# Altium schematic sheet 08.PCIE Fun Map.SchDoc
size 594 x 420 mm; Revision: V2.1; Schematic Page Number: 11; Page Number: 9; Check: <Checker>; Schematic Name: RK_NVR_DEMO1_RK3588_LP4/4x_V21; Page Count: 43; Page name: 08.PCIE Fun Map; Designer: Zhangdz; Schematic Page Count: 99; Revcode: V2.1; DsnPath: E:\Work\SBER\RK3588_SOM\temp\RK_NVR_DEMO1_RK3588_LP4XD200P232SD8_V21_20211228.DSN; SchematicName: RK_NVR_DEMO1_RK3588_LP4/4x_V21; PageName: 08.PCIE Fun Map; PageSize: A2; TopSchematic: True
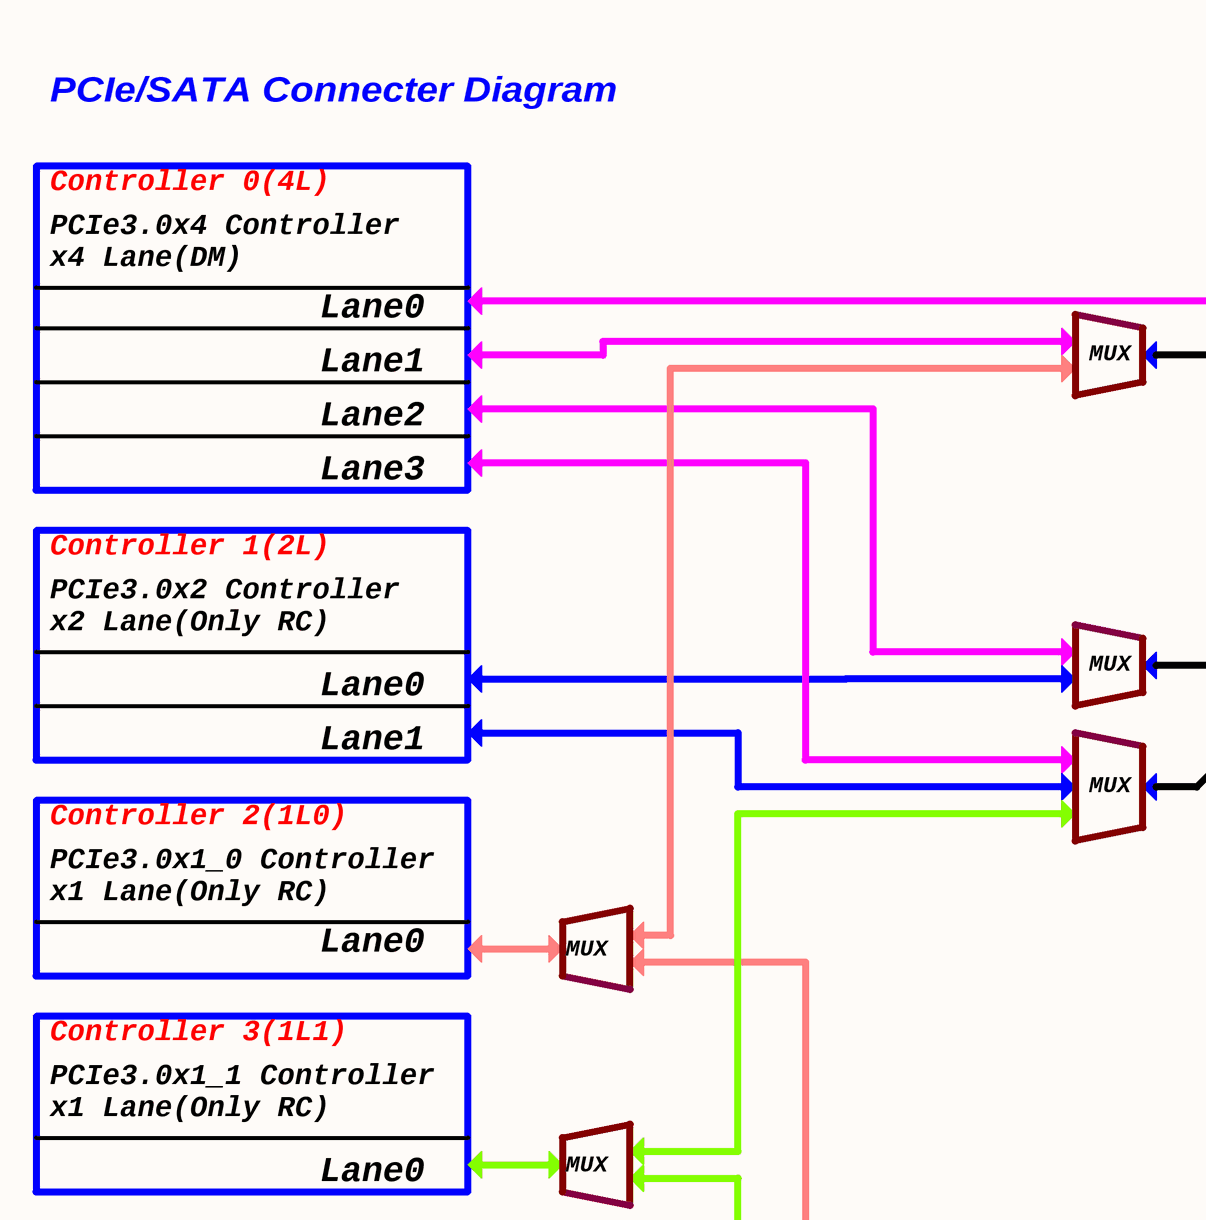
[diagram p0: 08.PCIE Fun Map.SchDoc, top left]
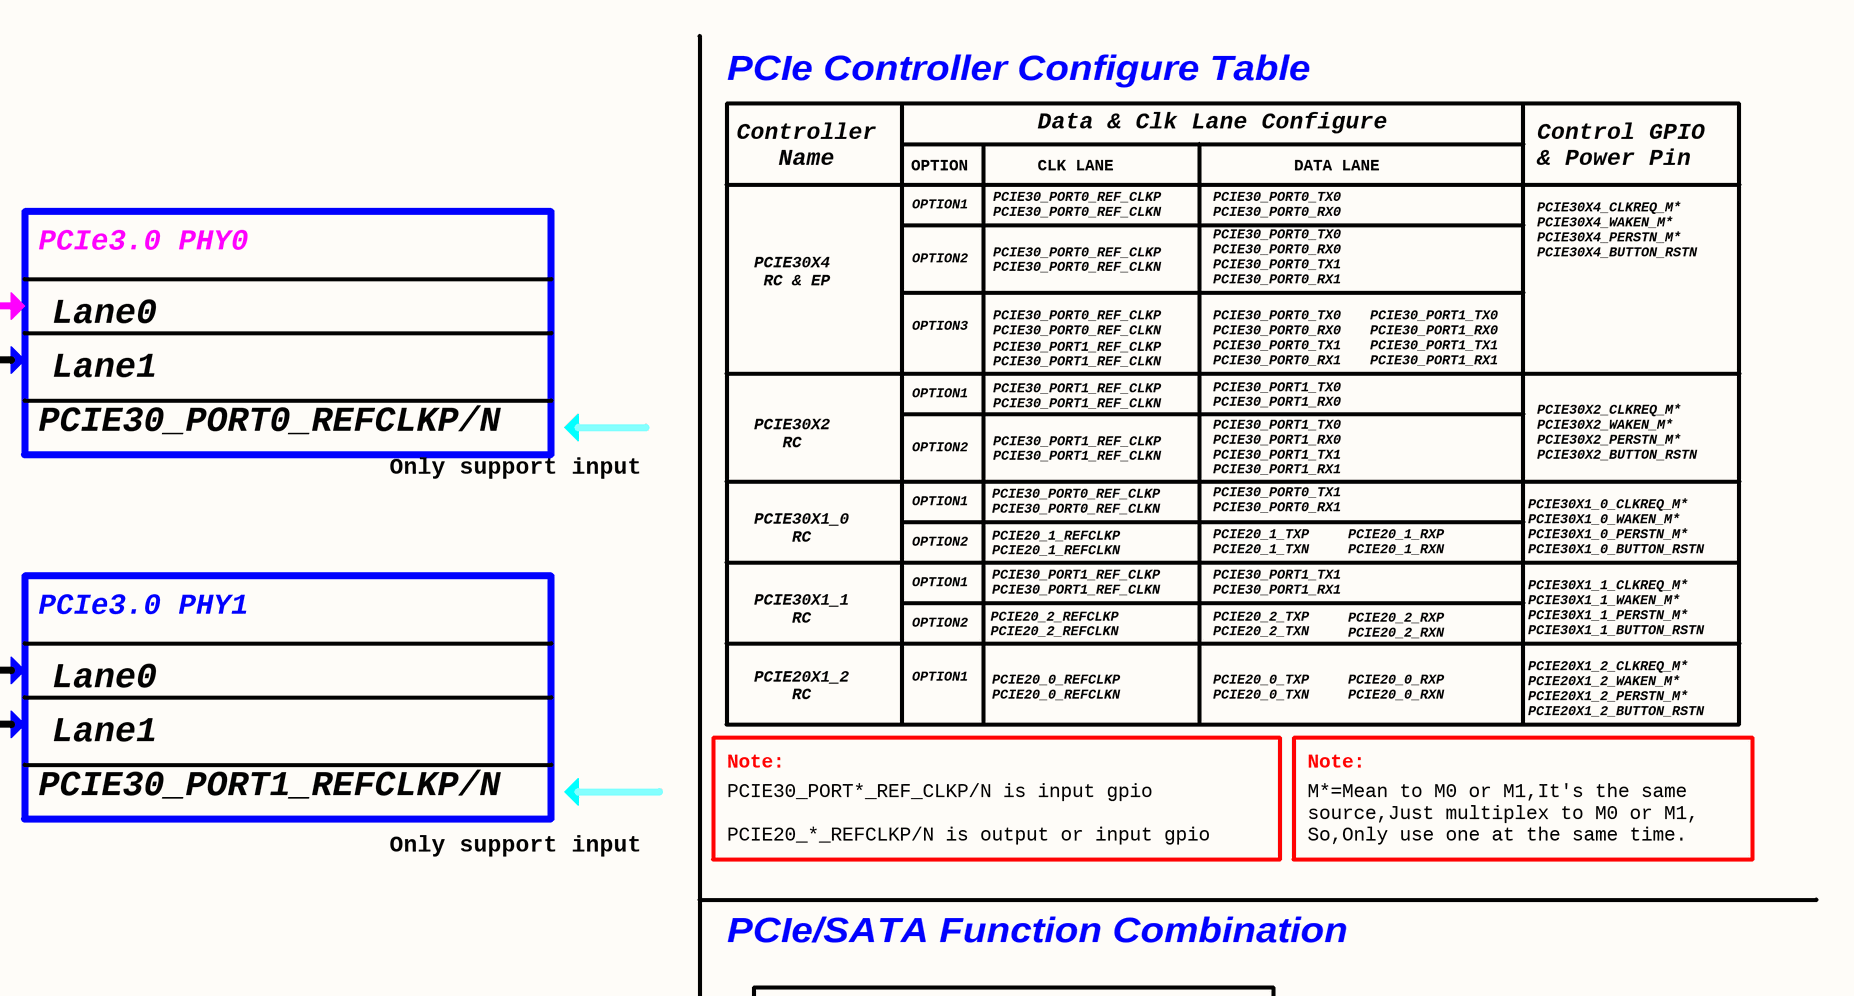
[diagram p1: 08.PCIE Fun Map.SchDoc, top right]
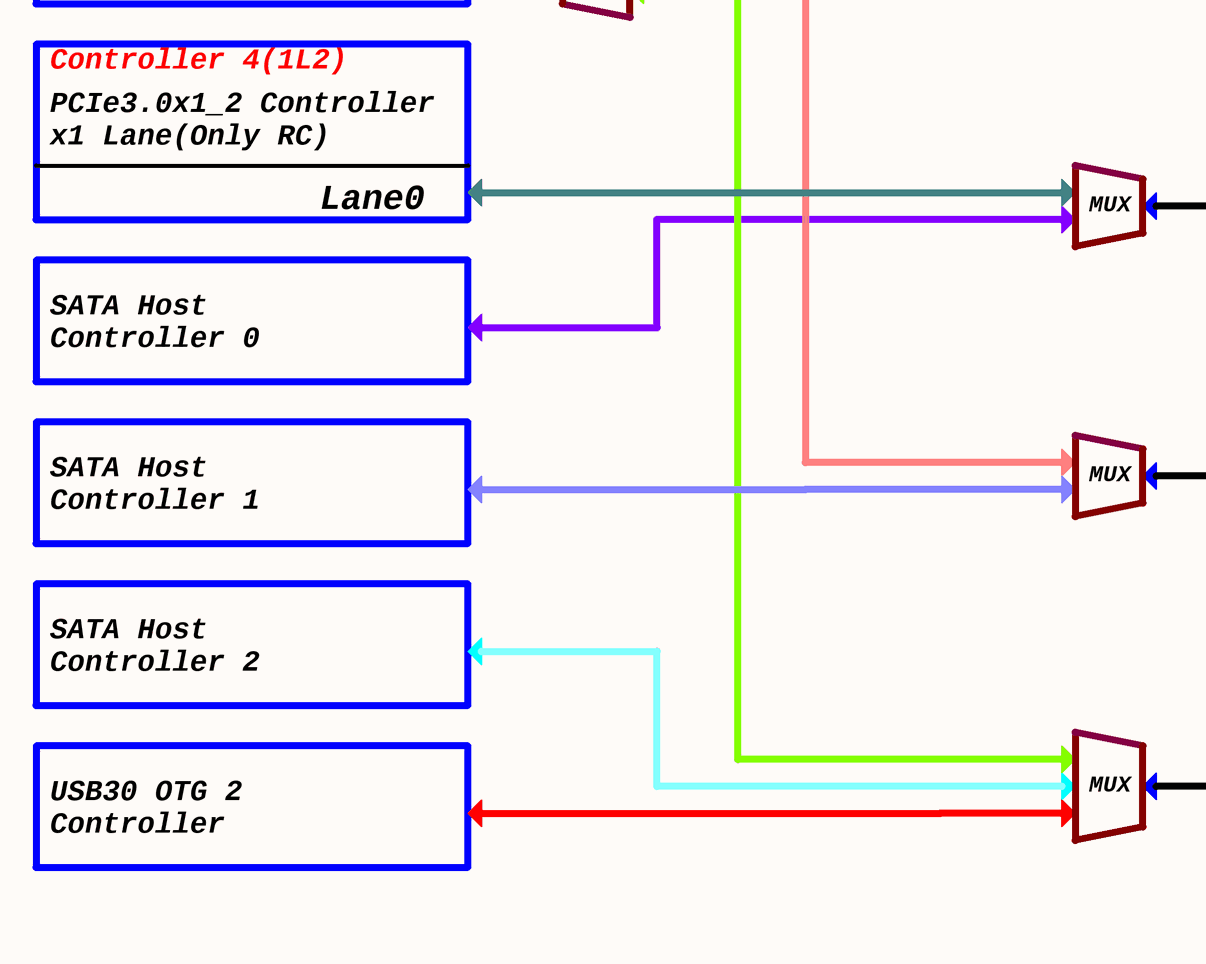
[diagram p2: 08.PCIE Fun Map.SchDoc, bottom left]
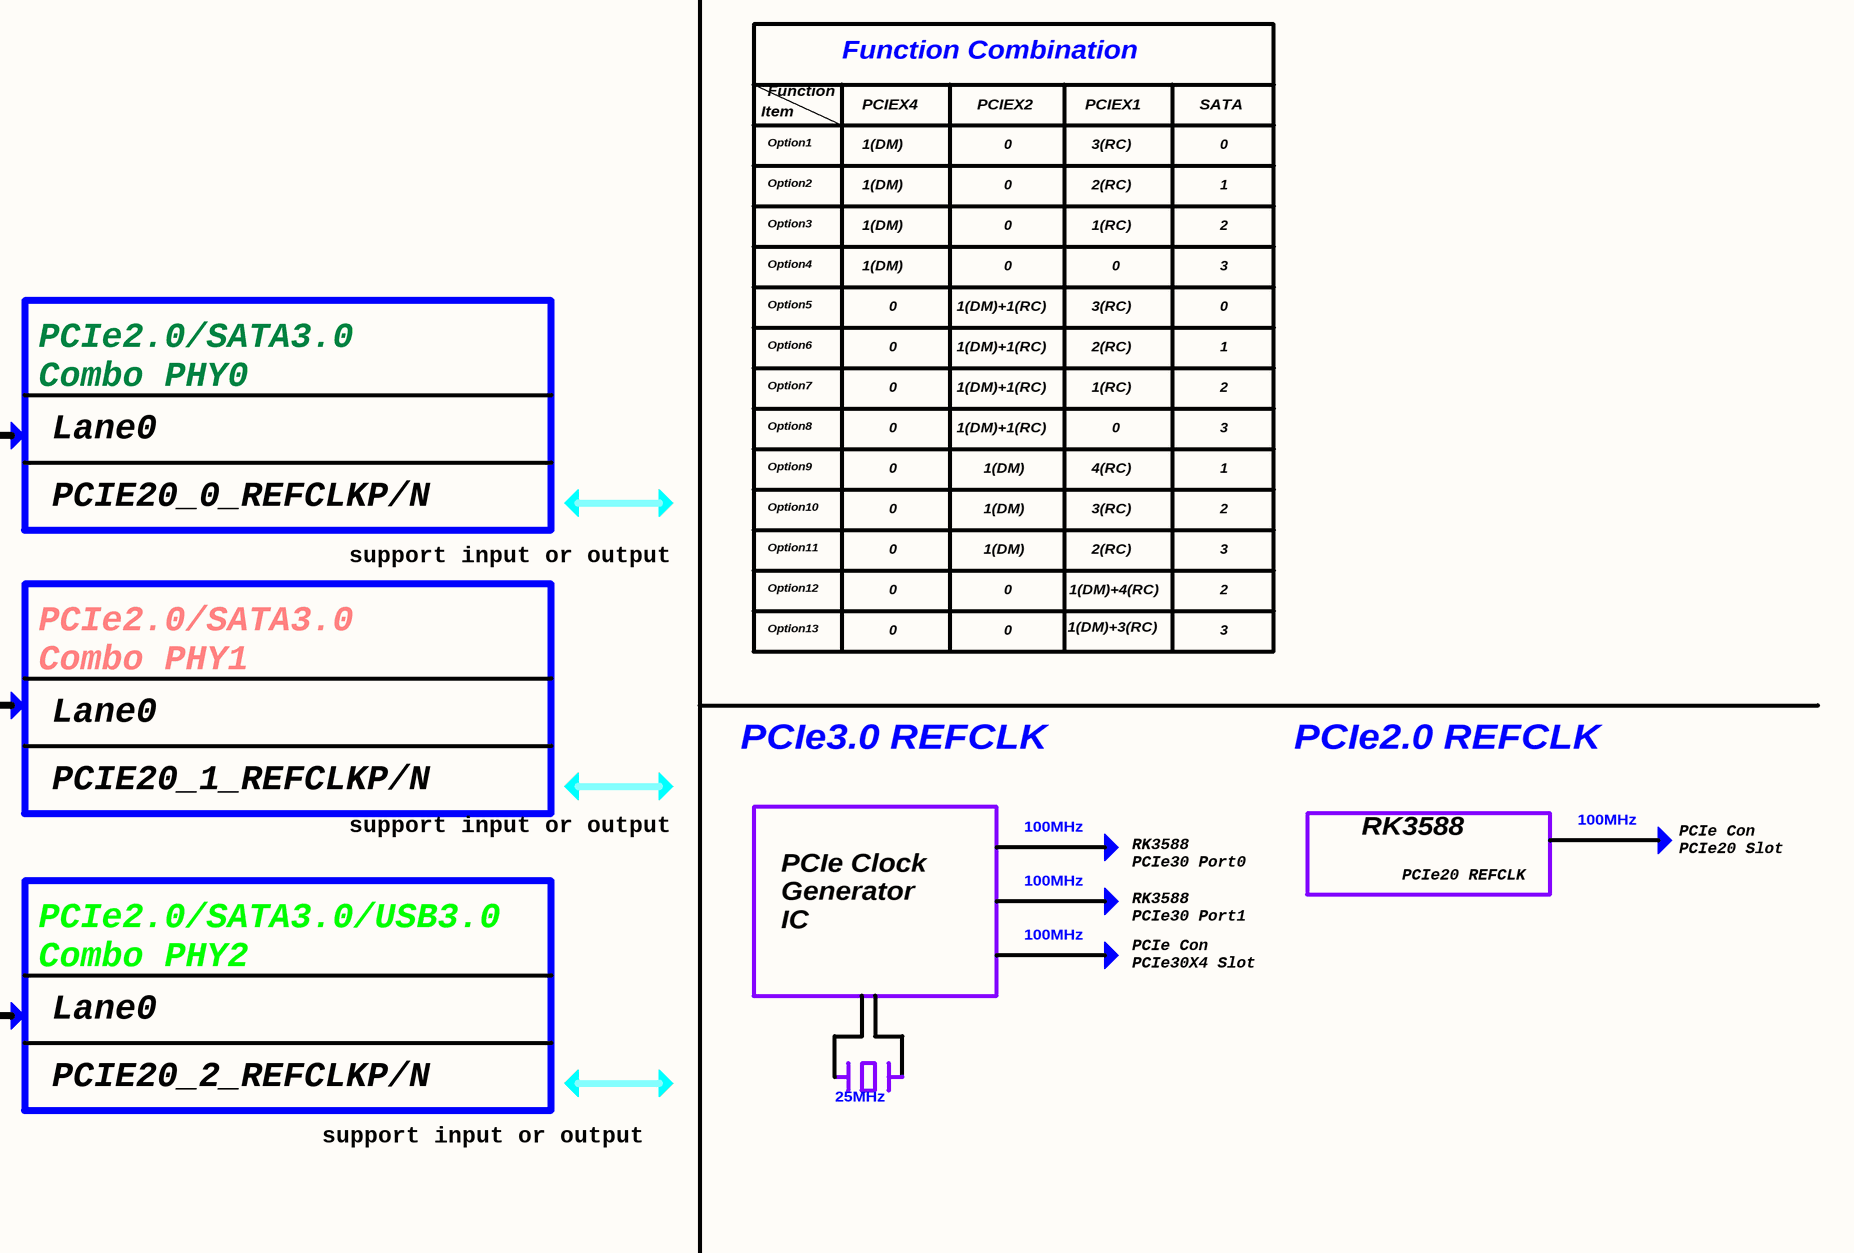
[diagram p3: 08.PCIE Fun Map.SchDoc, bottom right]

## Notes on the sheet
- PCIe Controller Configure Table
- PCIe/SATA Connecter Diagram
- Controller
  Name
- OPTION
- Data & Clk Lane Configure
- CLK LANE
- DATA LANE
- Control GPIO
  & Power Pin
- Controller 0(4L)
- OPTION1
- PCIE30_PORT0_REF_CLKP
  PCIE30_PORT0_REF_CLKN
- PCIE30_PORT0_TX0
  PCIE30_PORT0_RX0
- PCIe3.0x4 Controller
  x4 Lane(DM)
- PCIe3.0 PHY0
- PCIE30X4
  RC & EP
- OPTION2
- PCIE30_PORT0_TX0
  PCIE30_PORT0_RX0
  PCIE30_PORT0_TX1
  PCIE30_PORT0_RX1
- PCIE30X4_CLKREQ_M*
  PCIE30X4_WAKEN_M*
  PCIE30X4_PERSTN_M*
  PCIE30X4_BUTTON_RSTN
- Lane0
- MUX
- OPTION3
- PCIE30_PORT1_REF_CLKP
  PCIE30_PORT1_REF_CLKN
- PCIE30_PORT1_TX0
  PCIE30_PORT1_RX0
  PCIE30_PORT1_TX1
  PCIE30_PORT1_RX1
- Lane1
- Lane2
- PCIE30_PORT0_REFCLKP/N
- PCIE30_PORT1_TX0
  PCIE30_PORT1_RX0
- Lane3
- Only support input
- PCIE30X2
  RC
- PCIE30_PORT0_TX1
  PCIE30_PORT0_RX1
- PCIE30X2_CLKREQ_M*
  PCIE30X2_WAKEN_M*
  PCIE30X2_PERSTN_M*
  PCIE30X2_BUTTON_RSTN
- Controller 1(2L)
- PCIE30X1_0
  RC
- PCIE20_1_REFCLKP
  PCIE20_1_REFCLKN
- PCIE20_1_TXP
  PCIE20_1_TXN
- PCIE20_1_RXP
  PCIE20_1_RXN
- PCIE30X1_0_CLKREQ_M*
  PCIE30X1_0_WAKEN_M*
  PCIE30X1_0_PERSTN_M*
  PCIE30X1_0_BUTTON_RSTN
- PCIe3.0x2 Controller
  x2 Lane(Only RC)
- PCIe3.0 PHY1
- PCIE30X1_1
  RC
- PCIE20_2_REFCLKP
  PCIE20_2_REFCLKN
- PCIE30_PORT1_TX1
  PCIE30_PORT1_RX1
- PCIE20_2_TXP
  PCIE20_2_TXN
- PCIE20_2_RXP
  PCIE20_2_RXN
- PCIE30X1_1_CLKREQ_M*
  PCIE30X1_1_WAKEN_M*
  PCIE30X1_1_PERSTN_M*
  PCIE30X1_1_BUTTON_RSTN
- PCIE20X1_2
  RC
- PCIE20_0_REFCLKP
  PCIE20_0_REFCLKN
- PCIE20_0_TXP
  PCIE20_0_TXN
- PCIE20_0_RXP
  PCIE20_0_RXN
- PCIE20X1_2_CLKREQ_M*
  PCIE20X1_2_WAKEN_M*
  PCIE20X1_2_PERSTN_M*
  PCIE20X1_2_BUTTON_RSTN
- Note:
- Controller 2(1L0)
- PCIE30_PORT1_REFCLKP/N
- PCIE30_PORT*_REF_CLKP/N is input gpio
  PCIE20_*_REFCLKP/N is output or input gpio
- M*=Mean to M0 or M1,It's the same
  source,Just multiplex to M0 or M1,
  So,Only use one at the same time.
- PCIe3.0x1_0 Controller
  x1 Lane(Only RC)
- PCIe/SATA Function Combination
- Controller 3(1L1)
- Function Combination
- Item
- Option1
- Function
- PCIEX4
- 1(DM)
- PCIEX2
- 0
- PCIEX1
- 3(RC)
- SATA
- PCIe3.0x1_1 Controller
  x1 Lane(Only RC)
- Option2
- 2(RC)
- 1
- Option3
- Option4
- 1(RC)
- 2
- 3
- Controller 4(1L2)
- Option5
- Option6
- 1(DM)+1(RC)
- PCIe3.0x1_2 Controller
  x1 Lane(Only RC)
- PCIe2.0/SATA3.0
  Combo PHY0
- Option7
- Option8
- Option9
- 4(RC)
- PCIE20_0_REFCLKP/N
- Option10
- Option11
- SATA Host
  Controller 0
- support input or output
- Option12
- 1(DM)+4(RC)
- PCIe2.0/SATA3.0
  Combo PHY1
- Option13
- 1(DM)+3(RC)
- SATA Host
  Controller 1
- PCIe3.0 REFCLK
- PCIe2.0 REFCLK
- PCIE20_1_REFCLKP/N
- 100MHz
- RK3588
  PCIe30 Port0
- RK3588
- PCIe20 REFCLK
- PCIe Con
  PCIe20 Slot
- SATA Host
  Controller 2
- PCIe Clock
  Generator
  IC
- RK3588
  PCIe30 Port1
- PCIe2.0/SATA3.0/USB3.0
  Combo PHY2
- PCIe Con
  PCIe30X4 Slot
- USB30 OTG 2
  Controller
- PCIE20_2_REFCLKP/N
- 25MHz